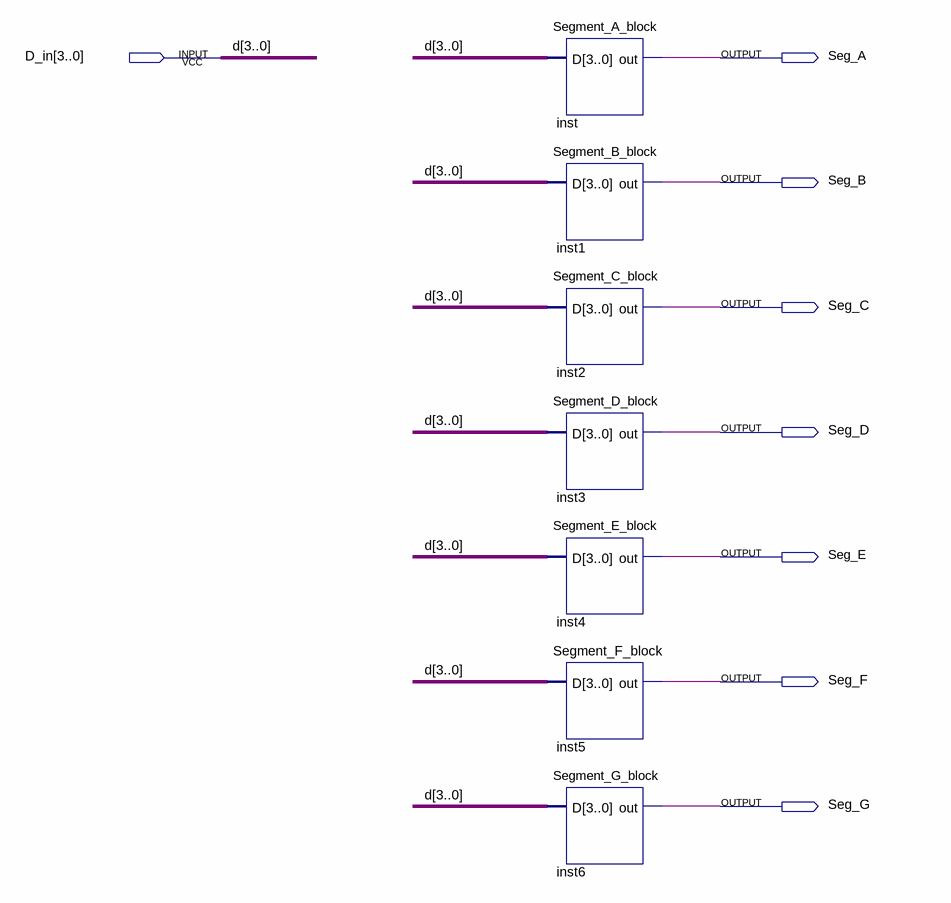
[diagram p0: schematic sheet]
// Quartus schematic 7Segment_decoder.bdf as structural Verilog: 7 symbols, 8 pins
module \7Segment_decoder  (
  input  [3:0] D_in,
  output Seg_A,
  output Seg_B,
  output Seg_C,
  output Seg_D,
  output Seg_E,
  output Seg_F,
  output Seg_G
);

  Segment_A_block inst (.D(D_in), .out(Seg_A));
  Segment_B_block inst1 (.D(D_in), .out(Seg_B));
  Segment_C_block inst2 (.D(D_in), .out(Seg_C));
  Segment_D_block inst3 (.D(D_in), .out(Seg_D));
  Segment_E_block inst4 (.D(D_in), .out(Seg_E));
  Segment_F_block inst5 (.D(D_in), .out(Seg_F));
  Segment_G_block inst6 (.D(D_in), .out(Seg_G));

  // Other names for the same wires on the sheet: d[3:0] = D_in
endmodule
